# Altium schematic sheet 数粒机转接板.SchDoc
size A1
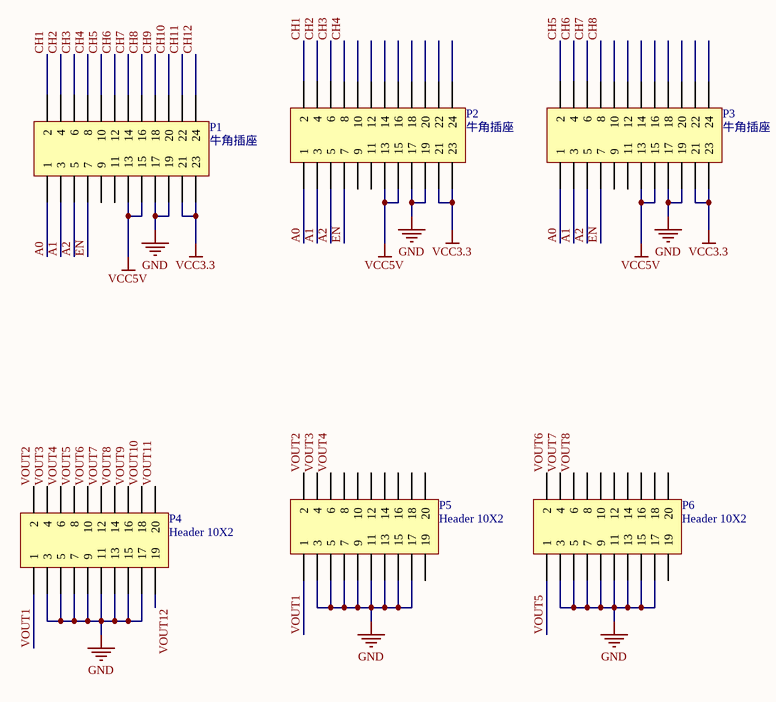
[diagram p0: 数粒机转接板.SchDoc]

## Parts
P1  牛角插座  [niujiaocha24p]
P2  牛角插座  [niujiaocha24p]
P3  牛角插座  [niujiaocha24p]
P4  Header 10X2  [niujiaocha20p]
P5  Header 10X2  [niujiaocha20p]
P6  Header 10X2  [niujiaocha20p]

## Nets
GND: P1.17 P1.19 P2.17 P2.19 P3.17 P3.19 P4.3 P4.5 P4.7 P4.9 P4.11 P4.13 P4.15 P4.17 P5.3 P5.5 P5.7 P5.9 P5.11 P5.13 P5.15 P5.17 P6.3 P6.5 P6.7 P6.9 P6.11 P6.13 P6.15 P6.17
VCC3.3: P1.21 P1.23 P2.21 P2.23 P3.21 P3.23
VCC5V: P1.13 P1.15 P2.13 P2.15 P3.13 P3.15
A0: P1.1 P2.1 P3.1
A1: P1.3 P2.3 P3.3
A2: P1.5 P2.5 P3.5
CH1: P1.2 P2.2
CH2: P1.4 P2.4
CH3: P1.6 P2.6
CH4: P1.8 P2.8
CH5: P1.10 P3.2
CH6: P1.12 P3.4
CH7: P1.14 P3.6
CH8: P1.16 P3.8
CH9: P1.18
CH10: P1.20
CH11: P1.22
CH12: P1.24
EN: P1.7 P2.7 P3.7
VOUT1: P4.1 P5.1
VOUT2: P4.2 P5.2
VOUT3: P4.4 P5.4
VOUT4: P4.6 P5.6
VOUT5: P4.8 P6.1
VOUT6: P4.10 P6.2
VOUT7: P4.12 P6.4
VOUT8: P4.14 P6.6
VOUT9: P4.16
VOUT10: P4.18
VOUT11: P4.20
VOUT12: P4.19

Not connected (* = marked no-connect by the designer): P1 9 11; P2 9 10 11 12 14 16 18 20 22 24; P3 9 10 11 12 14 16 18 20 22 24; P5 8 10 12 14 16 18 19 20; P6 8 10 12 14 16 18 19 20

## Library data of the parts
P1-P3 = Header 12X2: Header, 12-Pin, Dual row; LatestRevisionDate: 17-Jul-2002; LatestRevisionNote: Re-released for DXP Platform.; Publisher: Altium Limited
P4-P6 = Header 10X2: Header, 10-Pin, Dual row; LatestRevisionDate: 17-Jul-2002; LatestRevisionNote: Re-released for DXP Platform.; Publisher: Altium Limited